# Altium schematic sheet Smart Motor Switch.SchDoc
size A
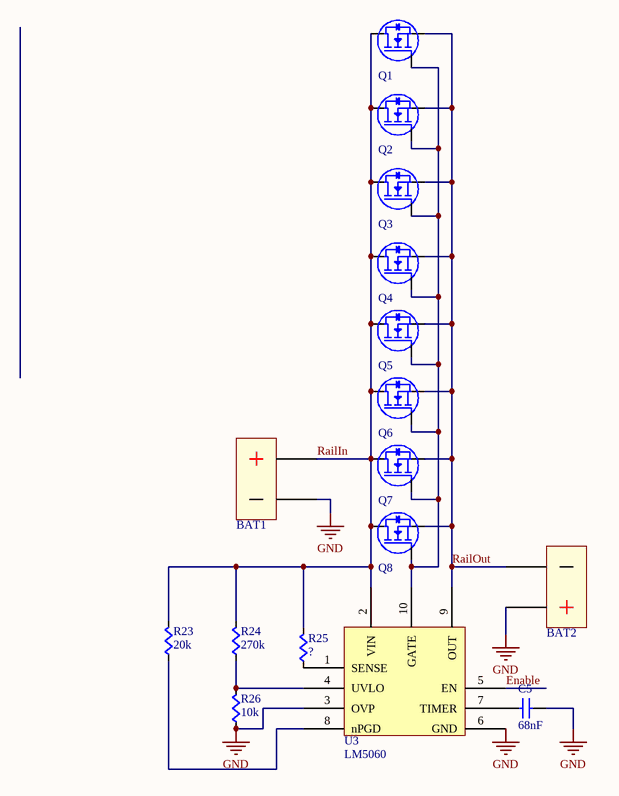
[diagram p0: Smart Motor Switch.SchDoc]

## Parts
BAT1  BATWIRE  [BATWIRE12]  (value not drawn)
BAT2  BATWIRE  [BATWIRE12]  (value not drawn)
C5  value 68nF  [CAPC0603]  (hidden comment: Cap)
Q1  CSD19502Q5B  [CSD19502Q5B]  (value not drawn)
Q2  CSD19502Q5B  [CSD19502Q5B]  (value not drawn)
Q3  CSD19502Q5B  [CSD19502Q5B]  (value not drawn)
Q4  CSD19502Q5B  [CSD19502Q5B]  (value not drawn)
Q5  CSD19502Q5B  [CSD19502Q5B]  (value not drawn)
Q6  CSD19502Q5B  [CSD19502Q5B]  (value not drawn)
Q7  CSD19502Q5B  [CSD19502Q5B]  (value not drawn)
Q8  CSD19502Q5B  [CSD19502Q5B]  (value not drawn)
R23  value 20k  [RES0603]  (hidden comment: Res)
R24  value 270k  [RES0603]  (hidden comment: Res)
R25  Res  [RES0603]  (value not drawn)
R26  value 10k  [RES0603]  (hidden comment: Res)
U3  LM5060  [LM5060]

## Nets
GND: BAT1.- BAT2.+ C5.2(B) R26.2(B) U3.3(OVP) U3.6(GND)
Enable: U3.5(EN)
RailIn: BAT1.+ Q1.D Q2.D Q3.D Q4.D Q5.D Q6.D Q7.D Q8.D R23.1(A) R24.1(A) R25.1(A) U3.2(VIN)
RailOut: BAT2.- Q1.S Q2.S Q3.S Q4.S Q5.S Q6.S Q7.S Q8.S U3.9(OUT)
NetC5_1: C5.1(A) U3.7(TIMER)
NetQ1_G: Q1.G Q2.G Q3.G Q4.G Q5.G Q6.G Q7.G Q8.G U3.10(GATE)
NetR23_2: R23.2(B) U3.8(nPGD)
NetR24_2: R24.2(B) R26.1(A) U3.4(UVLO)
NetR25_2: R25.2(B) U3.1(SENSE)

## Library data of the parts
BAT1 BAT2 = BATWIRE: Two large gauge leads soldered directly to the board.
Q1-Q8 = CSD19502Q5B: NEXFET Power MOSFET; Supplier 1: Digi-Key; Supplier Part Number 1: 296-37194-1-ND
U3 = LM5060: Hotswap Controller; Supplier 1: Digi-Key; Supplier Part Number 1: LM5060Q1MM/NOPBCT-ND
C5 = Cap: Supplier 1: Digi-Key; Supplier Part Number 1: 1276-1000-1-ND
R23-R26 = Res: Supplier 1: Digi-Key; Supplier Part Number 1: RMCF0603JT10K0CT-ND
  R25: Value: ?